# EAGLE design Sensor Board updated (EAGLE 9.5.1)
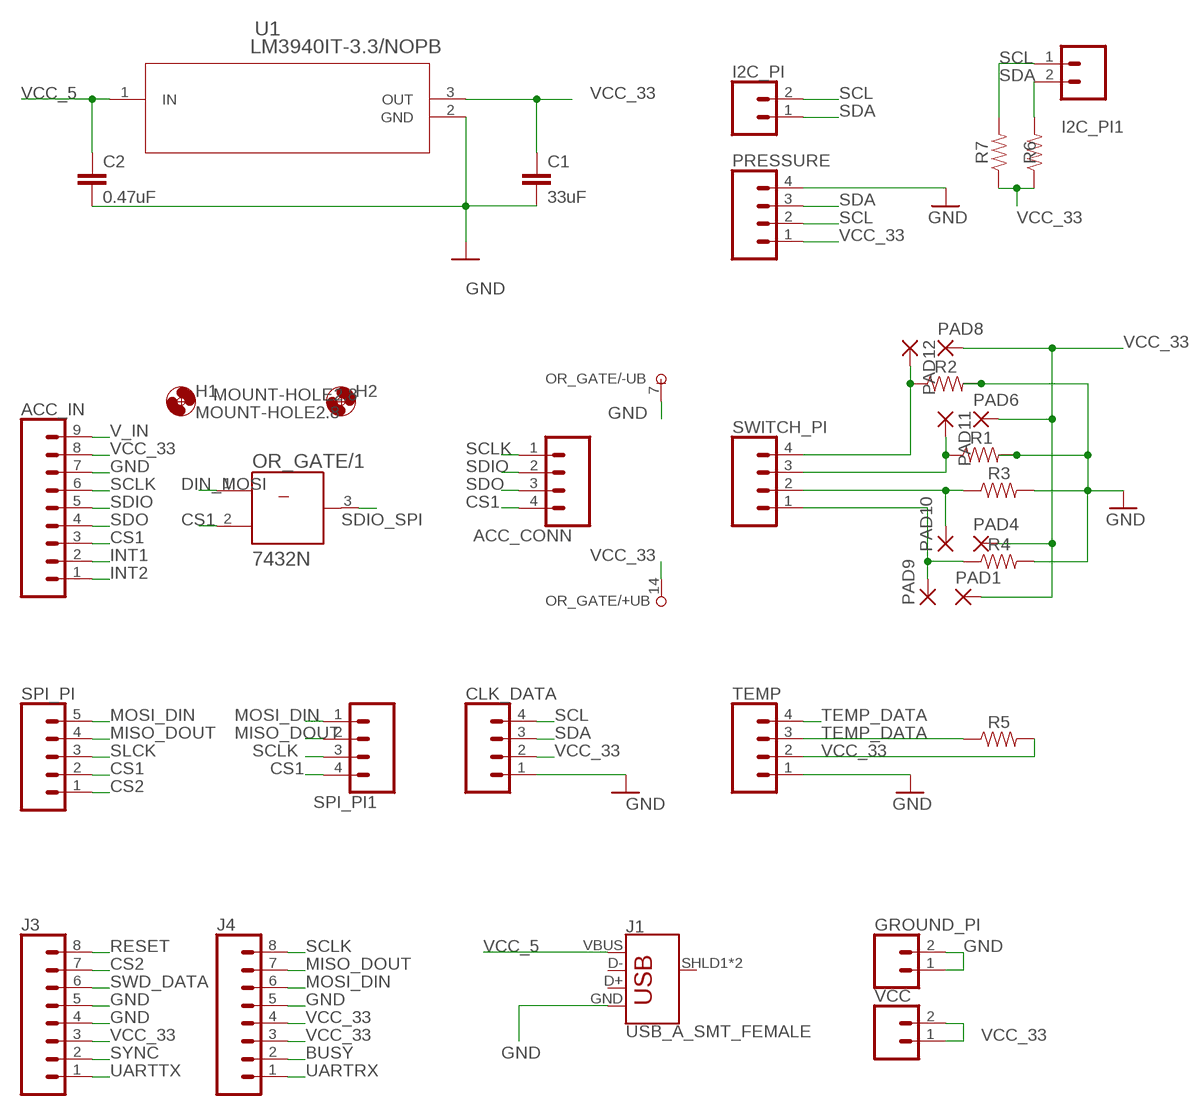
[diagram p0: schematic, sheet 1]

## Parts
ACC_CONN  CONN_04  [1X04]
ACC_IN  CONN_09  [1X09]
C1  33uF  C2.5/4  [C2.5-4]
C2  0.47uF  C2.5/4  [C2.5-4]
CLK_DATA  CONN_04  [1X04]
GROUND_PI  CONN_02  [1X02]
H1  MOUNT-HOLE2.8  [2,8]
H2  MOUNT-HOLE2.8  [2,8]
I2C_PI  CONN_02  [1X02]
I2C_PI1  CONN_02  [1X02]
J1  USB_A_SMT_FEMALE  [USB-A-S-SILK-FEMALE]
J3  CONN_08"  [1X08]
J4  CONN_08"  [1X08]
OR_GATE  7432N  [DIL14]
PAD1  1,6/0,8  [1,6/0,8]
PAD4  1,6/0,8  [1,6/0,8]
PAD6  1,6/0,8  [1,6/0,8]
PAD8  1,6/0,8  [1,6/0,8]
PAD9  1,6/0,8  [1,6/0,8]
PAD10  1,6/0,8  [1,6/0,8]
PAD11  1,6/0,8  [1,6/0,8]
PAD12  1,6/0,8  [1,6/0,8]
PRESSURE  CONN_04  [1X04]
R1  RESISTORAXIAL-0.3  [AXIAL-0.3]
R2  RESISTORAXIAL-0.3  [AXIAL-0.3]
R3  RESISTORAXIAL-0.3  [AXIAL-0.3]
R4  RESISTORAXIAL-0.3  [AXIAL-0.3]
R5  RESISTORAXIAL-0.3  [AXIAL-0.3]
R6  RESISTORAXIAL-0.3  [AXIAL-0.3]
R7  RESISTORAXIAL-0.3  [AXIAL-0.3]
SPI_PI  CONN_05  [1X05]
SPI_PI1  CONN_04  [1X04]
SWITCH_PI  CONN_04  [1X04]
TEMP  CONN_04  [1X04]
U1  LM3940IT-3.3/NOPB  [T03B]
VCC  CONN_02  [1X02]

## Nets
BUSY: J4.2
CS1: ACC_CONN.4 ACC_IN.3 OR_GATE.2(/1:B) SPI_PI1.4 SPI_PI.2
CS2: J3.7 SPI_PI.1
DIN_MOSI: OR_GATE.1(/1:A)
GND: ACC_IN.7 C1.2 C2.2 CLK_DATA.1 GROUND_PI.1 GROUND_PI.2 J1.GND J3.4 J3.5 J4.5 OR_GATE.7(/-UB:-UB) PRESSURE.4 R1.P$2 R2.P$2 R3.P$2 R4.P$2 TEMP.1 U1.2(GND)
INT1: ACC_IN.2
INT2: ACC_IN.1
MISO_DOUT: J4.7 SPI_PI1.2 SPI_PI.4
MOSI_DIN: J4.6 SPI_PI1.1 SPI_PI.5
N$11: PAD10.1(P) R3.P$1 SWITCH_PI.2
N$12: PAD9.1(P) R4.P$1 SWITCH_PI.1
N$13: PAD11.1(P) R1.P$1 SWITCH_PI.3
N$14: PAD12.1(P) R2.P$1 SWITCH_PI.4
RESET: J3.8
SCL: CLK_DATA.4 I2C_PI1.1 I2C_PI.2 PRESSURE.2 R7.P$2
SCLK: ACC_CONN.1 ACC_IN.6 J4.8 SPI_PI1.3
SDA: CLK_DATA.3 I2C_PI1.2 I2C_PI.1 PRESSURE.3 R6.P$2
SDIO: ACC_CONN.2 ACC_IN.5
SDIO_SPI: OR_GATE.3(/1:Y)
SDO: ACC_CONN.3 ACC_IN.4
SLCK: SPI_PI.3
SWD_DATA: J3.6
SYNC: J3.2
TEMP_DATA: R5.P$1 TEMP.3 TEMP.4
UARTRX: J4.1
UARTTX: J3.1
V_IN: ACC_IN.9
VCC_5: C2.1 J1.VBUS U1.1(IN)
VCC_33: ACC_IN.8 C1.1 CLK_DATA.2 J3.3 J4.3 J4.4 OR_GATE.14(/+UB:+UB) PAD1.1(P) PAD4.1(P) PAD6.1(P) PAD8.1(P) PRESSURE.1 R5.P$2 R6.P$1 R7.P$1 TEMP.2 U1.3(OUT) VCC.1 VCC.2
Unconnected: J1.D+ J1.D- J1.SHLD1(SHIELD) J1.SHLD2(SHIELD) OR_GATE.4(/2:A) OR_GATE.5(/2:B) OR_GATE.6(/2:Y) OR_GATE.8(/3:Y) OR_GATE.9(/3:A) OR_GATE.10(/3:B) OR_GATE.11(/4:Y) OR_GATE.12(/4:A) OR_GATE.13(/4:B)

## Library data of the parts
ACC_CONN CLK_DATA PRESSURE SPI_PI1 SWITCH_PI TEMP = SparkFun-Connectors:CONN_04: Multi connection point. Often used as Generic Header-pin footprint for 0.1 inch spaced/style header connections On any of the 0.1 inch spaced packages, you can populate with these: Break Away Headers - Straight <https://www.sparkfun.com/products/116> (PRT-00116) Break Away Male Headers - Right Angle <https://www.sparkfun.com/products/553> (PRT-00553) Female Headers <https://www.sparkfun.com/products/115> (PRT-00115) Break Away Headers - Machine Pin <https://www.sparkfun.com/products/117> (PRT-00117) Break Away Female Headers - Swiss Machine Pin <https://www.sparkfun.com/products/743> (PRT-00743) For SCREWTERMINALS and SPRING TERMINALS visit here: Screw Terimnals on SparkFun.com <https://www.sparkfun.com/search/results?term=Screw+Terminals> (5mm/3.5mm/2.54mm spacing) This device is also useful as a general connection point to wire up your design to another part of your project. Our various solder wires solder well into these plated through hole pads. Hook-Up Wire - Assortment (Stranded, 22 AWG) <https://www.sparkfun.com/products/11375> (PRT-11375) Hook-Up Wire - Assortment (Solid Core, 22 AWG) <https://www.sparkfun.com/products/11367> (PRT-11367) View the entire wire category on our website here <https://www.sparkfun.com/categories/141> Special notes: Molex polarized connector foot print use with SKU : PRT-08231 with associated crimp pins and housings. 1MM SMD Version SKU: PRT-10208; PROD_ID: CONN-09696
ACC_IN = SparkFun-Connectors:CONN_09: Multi connection point. Often used as Generic Header-pin footprint for 0.1 inch spaced/style header connections On any of the 0.1 inch spaced packages, you can populate with these: Break Away Headers - Straight <https://www.sparkfun.com/products/116> (PRT-00116) Break Away Male Headers - Right Angle <https://www.sparkfun.com/products/553> (PRT-00553) Female Headers <https://www.sparkfun.com/products/115> (PRT-00115) Break Away Headers - Machine Pin <https://www.sparkfun.com/products/117> (PRT-00117) Break Away Female Headers - Swiss Machine Pin <https://www.sparkfun.com/products/743> (PRT-00743) For SCREWTERMINALS and SPRING TERMINALS visit here: Screw Terimnals on SparkFun.com <https://www.sparkfun.com/search/results?term=Screw+Terminals> (5mm/3.5mm/2.54mm spacing) This device is also useful as a general connection point to wire up your design to another part of your project. Our various solder wires solder well into these plated through hole pads. Hook-Up Wire - Assortment (Stranded, 22 AWG) <https://www.sparkfun.com/products/11375> (PRT-11375) Hook-Up Wire - Assortment (Solid Core, 22 AWG) <https://www.sparkfun.com/products/11367> (PRT-11367) View the entire wire category on our website here <https://www.sparkfun.com/categories/141> Special notes: Molex polarized connector foot print use with SKU : PRT-08231 with associated crimp pins and housings. 1MM SMD Version SKU: PRT-10208 NOTES ON THE VARIANTS LOCK and LOCK_LONGPADS... This footprint was designed to help hold the alignment of a through-hole component (i.e. 6-pin header) while soldering it into place. You may notice that each hole has been shifted either up or down by 0.005 of an inch from it's more standard position (which is a perfectly straight line). This slight alteration caused the pins (the squares in the middle) to touch the edges of the holes. Because they are alternating, it causes a "brace" to hold the component in place. 0.005 has proven to be the perfect amount of "off-center" position when using our standard breakaway headers. Although looks a little odd when you look at the bare footprint, once you have a header in there, the alteration is very hard to notice. Also,if you push a header all the way into place, it is covered up entirely on the bottom side.
C1 C2 = capacitor-wima:C: CAPACITOR naming: grid - package width
GROUND_PI I2C_PI I2C_PI1 VCC = SparkFun-Connectors:CONN_02: Multi connection point. Often used as Generic Header-pin footprint for 0.1 inch spaced/style header connections On any of the 0.1 inch spaced packages, you can populate with these: Break Away Headers - Straight <https://www.sparkfun.com/products/116> (PRT-00116) Break Away Male Headers - Right Angle <https://www.sparkfun.com/products/553> (PRT-00553) Female Headers <https://www.sparkfun.com/products/115> (PRT-00115) Break Away Headers - Machine Pin <https://www.sparkfun.com/products/117> (PRT-00117) Break Away Female Headers - Swiss Machine Pin <https://www.sparkfun.com/products/743> (PRT-00743) For SCREWTERMINALS and SPRING TERMINALS visit here: Screw Terimnals on SparkFun.com <https://www.sparkfun.com/search/results?term=Screw+Terminals> (5mm/3.5mm/2.54mm spacing) This device is also useful as a general connection point to wire up your design to another part of your project. Our various solder wires solder well into these plated through hole pads. Hook-Up Wire - Assortment (Stranded, 22 AWG) <https://www.sparkfun.com/products/11375> (PRT-11375) Hook-Up Wire - Assortment (Solid Core, 22 AWG) <https://www.sparkfun.com/products/11367> (PRT-11367) View the entire wire category on our website here <https://www.sparkfun.com/categories/141> Special notes: Molex polarized connector foot print use with: PRT-08233 with associated crimp pins and housings. 2.54_SCREWTERM for use with PRT-10571. 3.5mm Screw Terminal footprints for PRT-08084 5mm Screw Terminal footprints for use with PRT-08432
H1 H2 = holes:MOUNT-HOLE: MOUNTING HOLE with drill center marker
J1 = SparkFun-Connectors:USB_A: USB-A Connector Male and female variants, as well as PTH and SMT variants SparkFun Products: SparkFun XBee Explorer Dongle <https://www.sparkfun.com/products/11697> PTH Male SparkFun MicroView-USB Programmer <https://www.sparkfun.com/products/12924> SMT Male SparkFun USB Type A Female Breakout <https://www.sparkfun.com/products/12700> SMT Female; PROD_ID: CONN-09520; SF_ID: PRT-09011
J3 J4 = SparkFun-Connectors:CONN_08: Multi connection point. Often used as Generic Header-pin footprint for 0.1 inch spaced/style header connections On any of the 0.1 inch spaced packages, you can populate with these: Break Away Headers - Straight <https://www.sparkfun.com/products/116> (PRT-00116) Break Away Male Headers - Right Angle <https://www.sparkfun.com/products/553> (PRT-00553) Female Headers <https://www.sparkfun.com/products/115> (PRT-00115) Break Away Headers - Machine Pin <https://www.sparkfun.com/products/117> (PRT-00117) Break Away Female Headers - Swiss Machine Pin <https://www.sparkfun.com/products/743> (PRT-00743) Arduino Stackable Header - 8 Pin <https://www.sparkfun.com/products/9279> (PRT-09279) For SCREWTERMINALS and SPRING TERMINALS visit here: Screw Terimnals on SparkFun.com <https://www.sparkfun.com/search/results?term=Screw+Terminals> (5mm/3.5mm/2.54mm spacing) This device is also useful as a general connection point to wire up your design to another part of your project. Our various solder wires solder well into these plated through hole pads. Hook-Up Wire - Assortment (Stranded, 22 AWG) <https://www.sparkfun.com/products/11375> (PRT-11375) Hook-Up Wire - Assortment (Solid Core, 22 AWG) <https://www.sparkfun.com/products/11367> (PRT-11367) View the entire wire category on our website here <https://www.sparkfun.com/categories/141> Special notes: Molex polarized connector foot print use with SKU : PRT-08231 with associated crimp pins and housings. 1MM SMD Version SKU: PRT-10208 NOTES ON THE VARIANTS LOCK and LOCK_LONGPADS... This footprint was designed to help hold the alignment of a through-hole component (i.e. 6-pin header) while soldering it into place. You may notice that each hole has been shifted either up or down by 0.005 of an inch from it's more standard position (which is a perfectly straight line). This slight alteration caused the pins (the squares in the middle) to touch the edges of the holes. Because they are alternating, it causes a "brace" to hold the component in place. 0.005 has proven to be the perfect amount of "off-center" position when using our standard breakaway headers. Although looks a little odd when you look at the bare footprint, once you have a header in there, the alteration is very hard to notice. Also,if you push a header all the way into place, it is covered up entirely on the bottom side.; PROD_ID: CONN-08438
OR_GATE = 74ttl-din:74*32: Quad 2-input OR gate
PAD1 PAD4 PAD6 PAD8-PAD12 = wirepad:1,6/0,8: THROUGH-HOLE PAD
R1-R7 = SparkFun-Resistors:RESISTOR: Generic Resistor Package
SPI_PI = SparkFun-Connectors:CONN_05: Multi connection point. Often used as Generic Header-pin footprint for 0.1 inch spaced/style header connections On any of the 0.1 inch spaced packages, you can populate with these: Break Away Headers - Straight <https://www.sparkfun.com/products/116> (PRT-00116) Break Away Male Headers - Right Angle <https://www.sparkfun.com/products/553> (PRT-00553) Female Headers <https://www.sparkfun.com/products/115> (PRT-00115) Break Away Headers - Machine Pin <https://www.sparkfun.com/products/117> (PRT-00117) Break Away Female Headers - Swiss Machine Pin <https://www.sparkfun.com/products/743> (PRT-00743) For SCREWTERMINALS and SPRING TERMINALS visit here: Screw Terimnals on SparkFun.com <https://www.sparkfun.com/search/results?term=Screw+Terminals> (5mm/3.5mm/2.54mm spacing) This device is also useful as a general connection point to wire up your design to another part of your project. Our various solder wires solder well into these plated through hole pads. Hook-Up Wire - Assortment (Stranded, 22 AWG) <https://www.sparkfun.com/products/11375> (PRT-11375) Hook-Up Wire - Assortment (Solid Core, 22 AWG) <https://www.sparkfun.com/products/11367> (PRT-11367) View the entire wire category on our website here <https://www.sparkfun.com/categories/141> Special notes: Molex polarized connector foot print use with SKU : PRT-08231 with associated crimp pins and housings. 1MM SMD Version SKU: PRT-10208
U1 = Canrgx:LM3940IT-3.3/NOPB; BUILT_BY: EMA_UL_Team; MANUFACTURER_PART_NUMBER: LM3940IT-3.3/NOPB; VENDOR: Texas Instruments

## Board
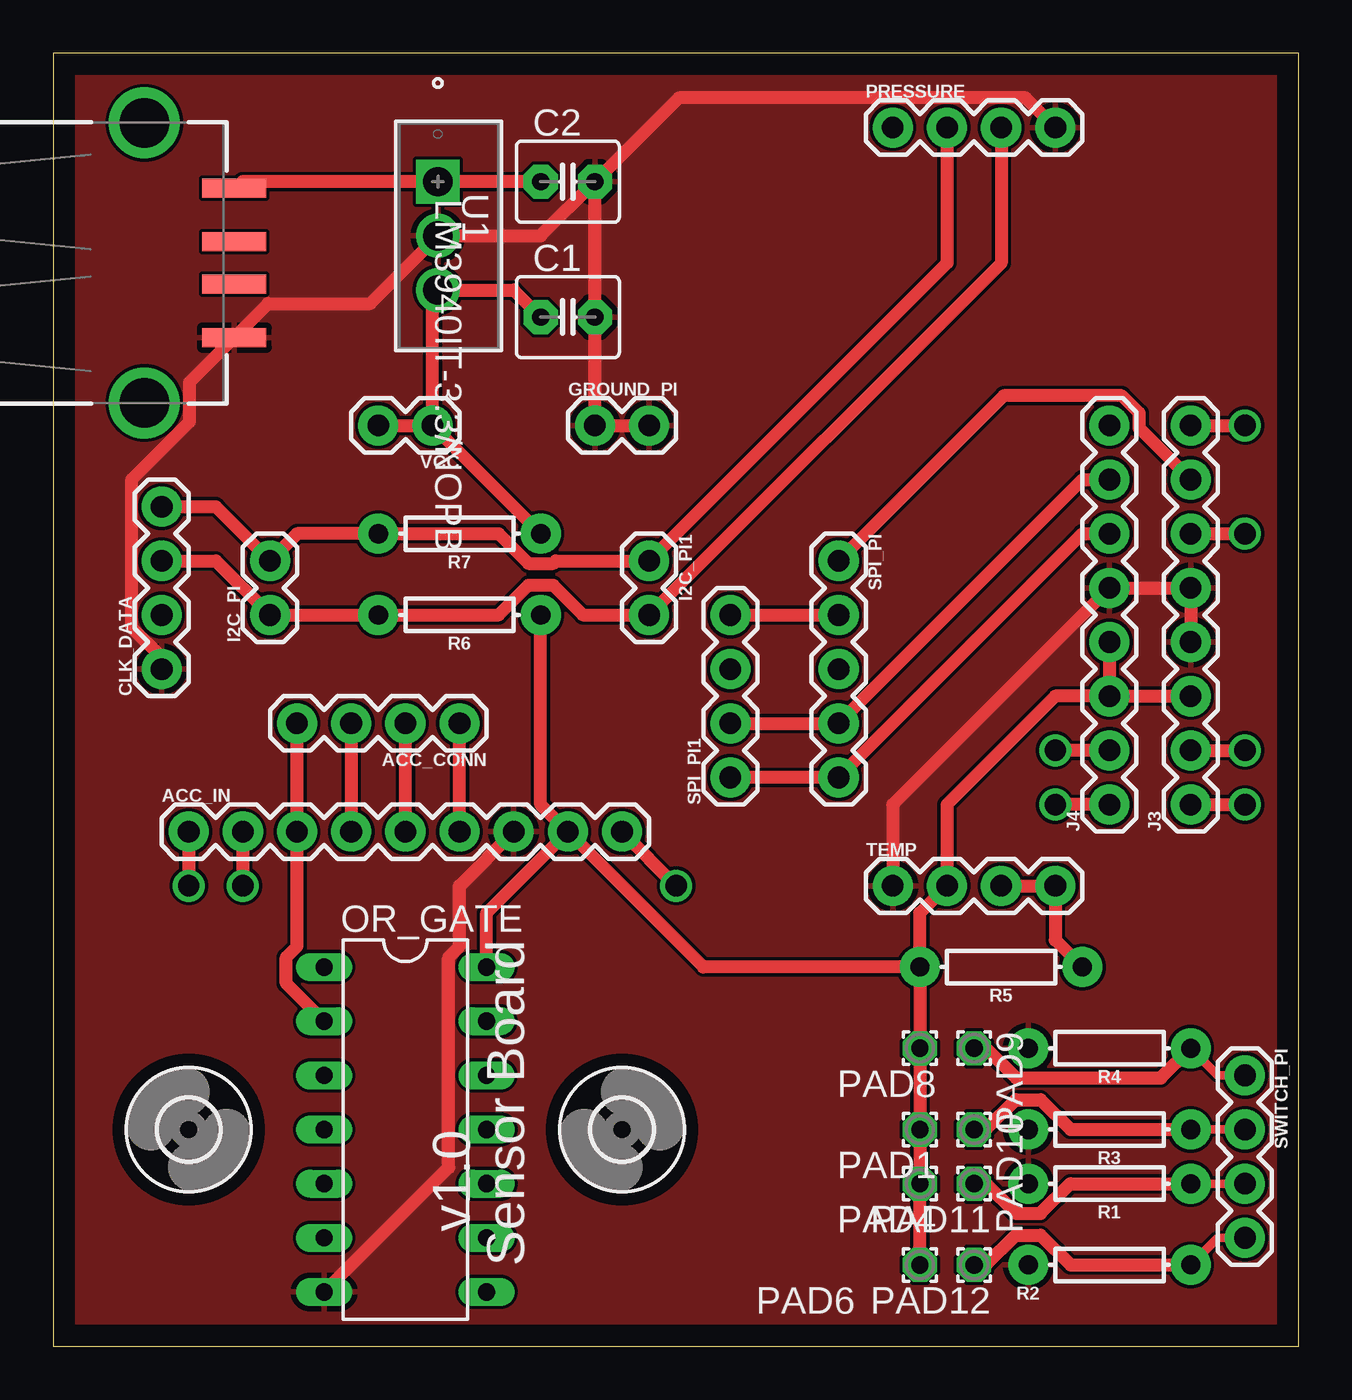
[diagram p1: board, top side]
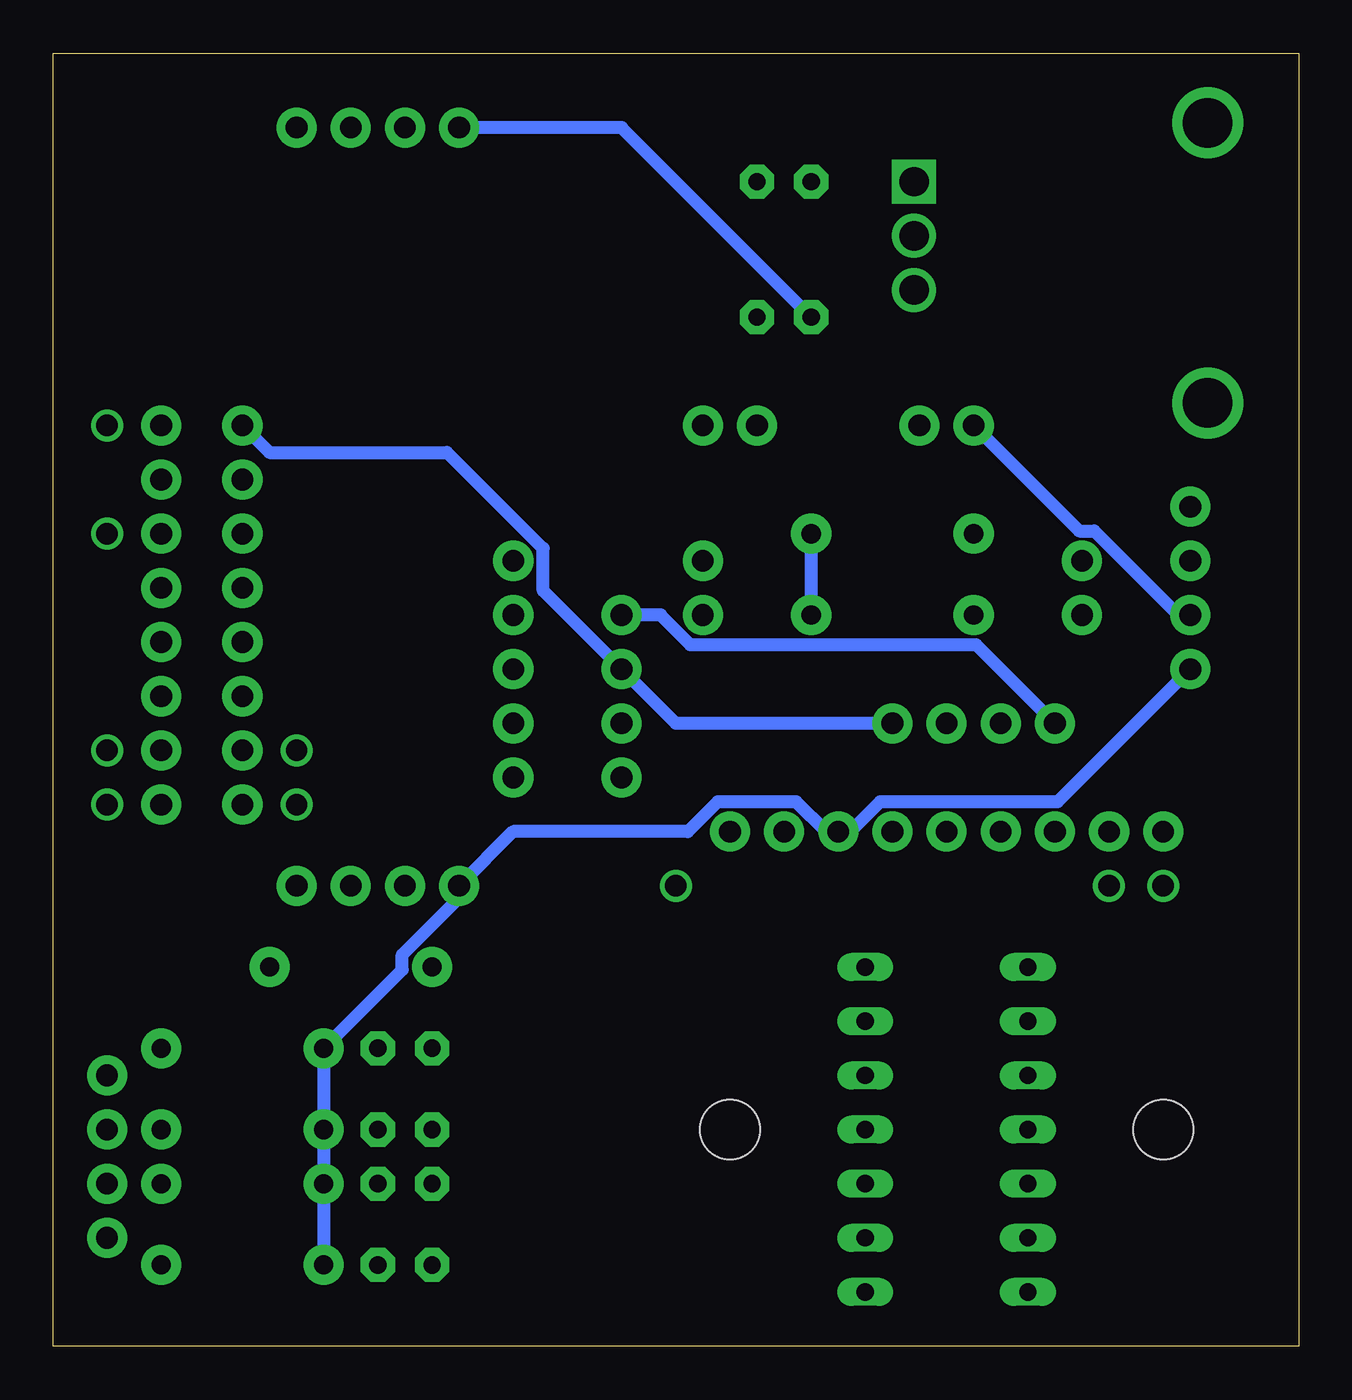
[diagram p2: board, bottom side, seen from below]

Size 58.4 x 60.63 mm. Coordinates in mm from the lower left corner, seen from the top.
Outline: 0,0 58.4,0 58.4,60.63 0,60.63 0,0
Copper layers (1*16): Top 0.035mm / dielectric 1.5mm / Bottom 0.035mm
Design rules "default": minimum track width 6mil, minimum drill 0.35mm, track to track 6mil, track to pad 6mil, pad to pad 6mil, via to via 6mil, smd to smd 6mil, copper to edge 40mil, drill to drill 6mil, minimum pad ring 10mil, minimum via ring 8mil, stop-mask expansion 4mil, vias tented up to drill 0mil, thermal gap 10mil

### Footprints (pad centres in the part's own frame; a part is rotated, then mirrored left to right if it is on the bottom)
1X04 = drill 1.016 pad 1.88: 1 0,0; 2 2.54,0; 3 5.08,0; 4 7.62,0
1X09 = drill 1.016 pad 1.88: 1 0,0; 2 2.54,0; 3 5.08,0; 4 7.62,0; 5 10.16,0; 6 12.7,0; 7 15.24,0; 8 17.78,0; 9 20.32,0
C2.5-4 = drill 0.813 pad 1.6 octagon: 1 -1.27,0; 2 1.27,0
1X02 = drill 1.016 pad 1.88: 1 0,0; 2 2.54,0
2,8 = hole 2.8: 0,0
USB-A-S-SILK-FEMALE = smd 3 x 0.9: D+ 7.212,-1; D- 7.212,1; GND 7.212,-3.5; VBUS 7.212,3.5 | drill 2.311: SHLD1 3,-6.566; SHLD2 3,6.566
1X08 = drill 1.016 pad 1.88: 1 0,0; 2 2.54,0; 3 5.08,0; 4 7.62,0; 5 10.16,0; 6 12.7,0; 7 15.24,0; 8 17.78,0
DIL14 = drill 0.813 long: 1 -7.62,-3.81; 2 -5.08,-3.81; 3 -2.54,-3.81; 4 0,-3.81; 5 2.54,-3.81; 6 5.08,-3.81; 7 7.62,-3.81; 8 7.62,3.81; 9 5.08,3.81; 10 2.54,3.81; 11 0,3.81; 12 -2.54,3.81; 13 -5.08,3.81; 14 -7.62,3.81
1,6/0,8 = drill 0.813 pad 1.6 octagon: 1 0,0
AXIAL-0.3 = drill 0.9 pad 1.88: P$1 -3.81,0; P$2 3.81,0
1X05 = drill 1.016 pad 1.88: 1 0,0; 2 2.54,0; 3 5.08,0; 4 7.62,0; 5 10.16,0
T03B = drill 1.372 pad 1.88 square: 1 -5.08,-1.016 | drill 1.372 pad 1.88: 2 -2.54,-1.016; 3 0,-1.016

### Placement (x,y rotation side)
ACC_CONN  19.05,29.21 180 top
ACC_IN  6.35,24.13 0 top
C1  24.13,48.26 0 top
C2  24.13,54.61 0 top
CLK_DATA  5.08,31.75 90 top
GROUND_PI  25.4,43.18 0 top
H1  26.67,10.16 0 top
H2  6.35,10.16 270 top
I2C_PI  10.16,34.29 90 top
I2C_PI1  27.94,36.83 270 top
J1  1.27,50.8 0 top
J3  53.34,25.4 90 top
J4  49.53,25.4 90 top
OR_GATE  16.51,10.16 270 top
PAD1  40.64,10.16 180 top
PAD4  40.64,7.62 180 top
PAD6  40.64,3.81 180 top
PAD8  40.64,13.97 180 top
PAD9  43.18,13.97 270 top
PAD10  43.18,10.16 270 top
PAD11  43.18,7.62 180 top
PAD12  43.18,3.81 180 top
PRESSURE  39.37,57.15 0 top
R1  49.53,7.62 180 top
R2  49.53,3.81 180 top
R3  49.53,10.16 180 top
R4  49.53,13.97 180 top
R5  44.45,17.78 180 top
R6  19.05,34.29 180 top
R7  19.05,38.1 180 top
SPI_PI  36.83,36.83 270 top
SPI_PI1  31.75,26.67 90 top
SWITCH_PI  55.88,12.7 270 top
TEMP  39.37,21.59 0 top
U1  19.05,49.53 270 top
VCC  17.78,43.18 180 top

### Tracks (layer width: path | path; a pad name or v marks a point on that pad's centre or on a via)
BUSY  (via drill 1)
  Top 0.61: J4.2 v46.99,27.94
CS1
  Top 0.61: ACC_CONN.4 ACC_IN.3 11.43,18.75 10.92,18.24 10.92,17.02 OR_GATE.2 | SPI_PI1.4 SPI_PI.2
  Bottom 0.61: ACC_CONN.4 15.11,32.89 28.52,32.89 29.92,34.29 SPI_PI1.4
CS2
  Top 0.61: J3.7 50.93,43.05 50.93,43.76 50.11,44.58 44.58,44.58 SPI_PI.1
GND
  Top 0.406: 17.91,51.94 U1.2
  Top 0.61: U1.2 22.86,52.07 C2.2 | 17.91,51.94 14.86,48.89 10.07,48.89 J1.GND 6.39,45.21 6.39,43.36 3.68,40.65 3.68,33.71 5.08,32.31 CLK_DATA.1 | C2.2 C1.2 GROUND_PI.1 GROUND_PI.2 | ACC_IN.7 19.05,21.59 19.05,18.75 18.54,18.24 18.54,8.38 OR_GATE.7 | C2.2 29.34,58.55 45.59,58.55 PRESSURE.4 | 49.53,35 J4.5 | J4.5 J3.5 J3.4 | J4.5 39.37,25.4 TEMP.1
  Bottom 0.61: CLK_DATA.1 11.3,25.53 19.63,25.53 21.03,24.13 ACC_IN.7 22.15,24.13 23.55,25.53 27.25,25.53 28.65,24.13 36.83,24.13 TEMP.1 39.37,21.03 42.04,18.36 42.04,17.65 R4.P$2 R3.P$2 R1.P$2 R2.P$2
  pour Top: 0,60.96 58.42,60.96 58.42,0 0,0
INT1  (via drill 1)
  Top 0.61: ACC_IN.2 v8.89,21.59
INT2  (via drill 1)
  Top 0.61: ACC_IN.1 v6.35,21.59
MISO_DOUT
  Top 0.61: SPI_PI1.2 SPI_PI.4 48.26,40.64 J4.7
MOSI_DIN
  Top 0.61: SPI_PI1.1 SPI_PI.5 48.26,38.1 J4.6
N$11
  Top 0.406: SWITCH_PI.2 R3.P$1
  Top 0.61: PAD10.1 43.74,10.16 45.14,11.56 46.3,11.56 47.7,10.16 R3.P$1
N$12
  Top 0.406: SWITCH_PI.1 54.61,12.7 R4.P$1
  Top 0.61: PAD9.1 43.74,13.97 45.14,12.57 51.94,12.57 R4.P$1
N$13
  Top 0.406: SWITCH_PI.3 R1.P$1
  Top 0.61: PAD11.1 43.74,7.62 45.14,6.22 46.3,6.22 47.7,7.62 R1.P$1
N$14
  Top 0.406: R2.P$1 54.61,5.08 SWITCH_PI.4
  Top 0.61: PAD12.1 43.74,3.81 45.14,5.21 46.3,5.21 47.7,3.81 R2.P$1
RESET  (via drill 1)
  Top 0.61: J3.8 v55.88,43.18
SCL
  Top 0.61: CLK_DATA.4 7.62,39.37 I2C_PI.2 11.43,38.1 R7.P$2 20.88,38.1 22.28,36.7 23.44,36.7 23.57,36.83 I2C_PI1.1 41.91,50.8 PRESSURE.2
SCLK
  Top 0.61: ACC_IN.6 ACC_CONN.1
  Bottom 0.61: ACC_CONN.1 29.21,29.21 SPI_PI1.3 35.43,35.43 35.43,37.41 39.93,41.91 48.26,41.91 J4.8
SDA
  Top 0.61: CLK_DATA.3 7.62,36.83 I2C_PI.1 R6.P$2 20.88,34.29 22.28,35.69 23.44,35.69 24.84,34.29 I2C_PI1.2 44.45,50.8 PRESSURE.3
SDIO
  Top 0.61: ACC_IN.5 ACC_CONN.2
SDO
  Top 0.61: ACC_CONN.3 ACC_IN.4
SWD_DATA  (via drill 1)
  Top 0.61: J3.6 v55.88,38.1
SYNC  (via drill 1)
  Top 0.61: J3.2 v55.88,27.94
TEMP_DATA
  Top 0.61: R5.P$1 46.99,19.05 TEMP.4 TEMP.3
UARTRX  (via drill 1)
  Top 0.61: J4.1 v46.99,25.4
UARTTX  (via drill 1)
  Top 0.61: J3.1 v55.88,25.4
V_IN  (via drill 1)
  Top 0.61: ACC_IN.9 v29.21,21.59
VCC_5
  Top 0.406: J1.VBUS 8.79,54.61 8.89,54.61 U1.1 C2.1
  Top 0.61: C2.1 8.89,54.61
VCC_33
  Top 0.61: VCC.1 17.78,49.28 U1.3 21.59,49.53 C1.1 | VCC.2 VCC.1 | R7.P$1 VCC.1 | ACC_IN.8 22.86,25.4 R6.P$1 | OR_GATE.14 20.32,20.32 ACC_IN.8 | R5.P$2 30.48,17.78 ACC_IN.8 | R5.P$2 PAD8.1 PAD1.1 PAD4.1 PAD6.1 | R5.P$2 40.64,20.32 TEMP.2 41.91,25.4 46.99,30.48 J4.3 | J4.4 J4.3 | J4.3 J3.3
  Bottom 0.61: VCC.2 10.29,38.23 9.58,38.23 5.64,34.29 CLK_DATA.2 | R7.P$1 R6.P$1 | C1.1 31.75,57.15 PRESSURE.1

### Text on the board
tPlace: Sensor Board | v1.0